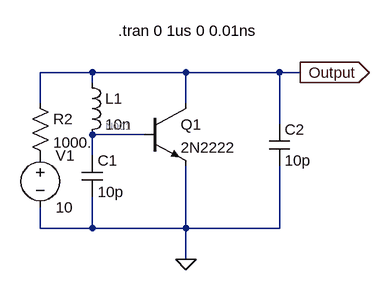
[diagram p0: schematic colpitts_jfet_model.asc]
colpitts_jfet_model.asc, the LTspice schematic file:
Version 4
SHEET 1 880 680
WIRE 128 0 48 0
WIRE 272 0 128 0
WIRE 416 0 272 0
WIRE 448 0 416 0
WIRE 128 16 128 0
WIRE 48 48 48 0
WIRE 272 48 272 0
WIRE 416 80 416 0
WIRE 208 96 128 96
WIRE 128 128 128 96
WIRE 48 240 48 208
WIRE 128 240 128 192
WIRE 128 240 48 240
WIRE 272 240 272 144
WIRE 272 240 128 240
WIRE 416 240 416 144
WIRE 416 240 272 240
WIRE 272 288 272 240
FLAG 272 288 0
FLAG 448 0 Output
IOPIN 448 0 Out
SYMBOL ind 112 0 R0
SYMATTR InstName L1
SYMATTR Value 10n
SYMBOL cap 112 128 R0
SYMATTR InstName C1
SYMATTR Value 10p
SYMBOL voltage 48 112 R0
WINDOW 123 0 0 Left 2
WINDOW 39 0 0 Left 2
SYMATTR InstName V1
SYMATTR Value 10
SYMBOL npn 208 48 R0
SYMATTR InstName Q1
SYMATTR Value 2N2222
SYMBOL res 32 32 R0
SYMATTR InstName R2
SYMATTR Value 1000.
SYMBOL cap 400 80 R0
SYMATTR InstName C2
SYMATTR Value 10p
TEXT 168 -64 Left 2 !.tran 0 1us 0 0.01ns

The netlist it stands for:
* colpitts_jfet_model.asc
L1 Output N001 10n
C1 N001 0 10p
V1 P001 0 10
Q1 Output N001 0 0 2N2222
R2 Output P001 1000.
C2 Output 0 10p
.model NPN NPN
.model PNP PNP
.lib standard.bjt
.tran 0 1us 0 0.01ns
.backanno
.end

* Results of the author's LTspice run, read from the files saved beside the schematic
* Operating Point, zero values left out:
*   V(output) = 715.7 mV
*   V(n001) = 715.7 mV
*   V(p001) = 10 V
*   Ic(Q1) = 9.237 mA
*   Ib(Q1) = 47.61 µA
*   Ie(Q1) = -9.284 mA
*   I(L1) = 47.61 µA
*   I(R2) = -9.284 mA
*   I(V1) = -9.284 mA
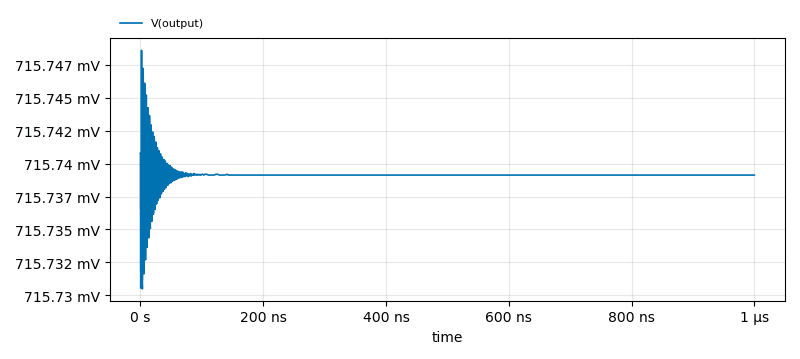
[diagram p1: Transient Analysis of colpitts_jfet_model.asc, plotted from the saved traces]
* Transient Analysis, 1 run:
*   V(output): min 715.7 mV, max 715.7 mV, average 715.7 mV, rms 715.7 mV, last 715.7 mV